# EAGLE design bleumaus-nrf52832-mk-1.0.0 (EAGLE 9.3.1)
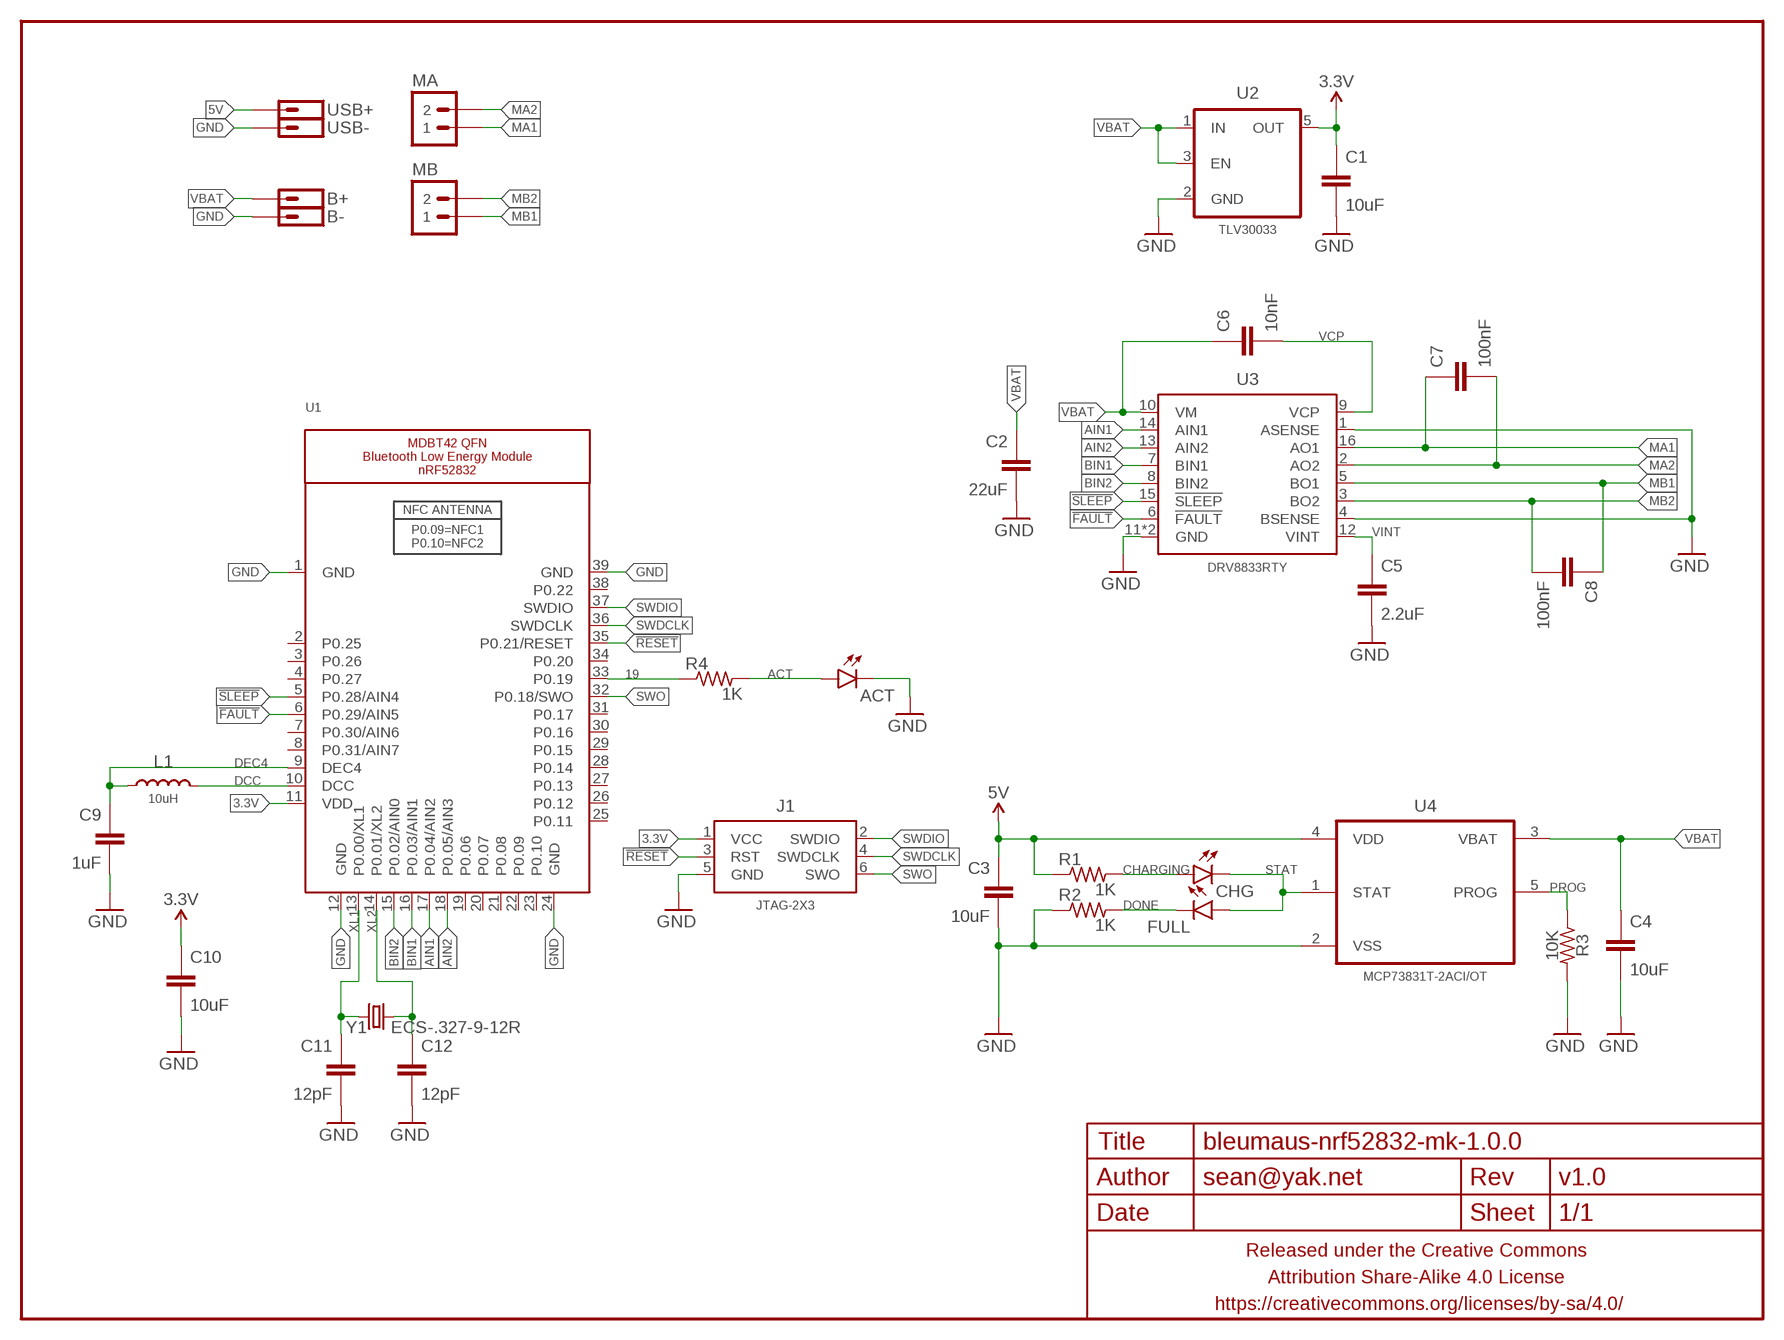
[diagram p0: schematic, sheet 1]

## Parts
ACT  LED0603-TIGHT  [LED-0603-TIGHT]
B+  M01SMD-1DIA  [1X01-SMD-1MM-DIA]
B-  M01SMD-1DIA  [1X01-SMD-1MM-DIA]
C1  10uF  CAPACITOR-CERAMICC0402  [C0402]
C2  22uF  CAPACITOR-CERAMICC1206  [C1206]
C3  10uF  CAPACITOR-CERAMICC0402  [C0402]
C4  10uF  CAPACITOR-CERAMICC0402  [C0402]
C5  2.2uF  CAPACITOR-CERAMICC0402  [C0402]
C6  10nF  CAPACITOR-CERAMICC0402  [C0402]
C7  100nF  CAPACITOR-CERAMICC0402  [C0402]
C8  100nF  CAPACITOR-CERAMICC0402  [C0402]
C9  1uF  CAPACITOR-CERAMICC0402  [C0402]
C10  10uF  CAPACITOR-CERAMICC0603-TIGHTER  [C0603-TIGHTER]
C11  12pF  CAPACITOR-CERAMICC0402  [C0402]
C12  12pF  CAPACITOR-CERAMICC0402  [C0402]
CHG  LED0603-TIGHT  [LED-0603-TIGHT]
FRAME1  FRAME-LETTERNO_PACKAGE  [DUMMY]
FULL  LED0603-TIGHT  [LED-0603-TIGHT]
J1  JTAG-2X3  [2X3-1.27MM-SMD]
L1  10uH  INDUCTOR0603  [0603]
MA  M02PTH-2MM  [1X02-2MM-PTH]
MB  M02PTH-2MM  [1X02-2MM-PTH]
R1  1K  RESISTORR0402  [R0402]
R2  1K  RESISTORR0402  [R0402]
R3  10K  RESISTORR0402  [R0402]
R4  1K  RESISTORR0402  [R0402]
U1  NRF52832_MODULE_MDBT42_NO2324  [BLE_MODULE_RAYTAC_MDBT42_NO2324]
U2  TLV30033  V_REG_ENTLV700XXDCK-TIGHTER  [SC70-TIGHTER]
U3  DRV8833RTY  [PWQFN-16]
U4  MCP73831T-2ACI/OT  [SOT95P280X145-5N]
USB+  M01SMD-1DIA  [1X01-SMD-1MM-DIA]
USB-  M01SMD-1DIA  [1X01-SMD-1MM-DIA]
Y1  ECS-.327-9-12R  CRYSTAL2X1.2MM  [CRYSTAL-2X1.2MM]

## Nets
3.3V: C1.1 C10.1 J1.1(VCC) U1.11(VDD) U2.5(OUT)
5V: C3.1 R1.1 U4.4(VDD) USB+.P$1
19: R4.1 U1.33(P0.19)
!FAULT: U1.6(P0.29/AIN5) U3.6(!FAULT)
!RESET: J1.3(RST) U1.35(P0.21/RESET)
!SLEEP: U1.5(P0.28/AIN4) U3.15(!SLEEP)
ACT: ACT.A R4.2
AIN1: U1.17(P0.04/AIN2) U3.14(AIN1)
AIN2: U1.18(P0.05/AIN3) U3.13(AIN2)
BIN1: U1.16(P0.03/AIN1) U3.7(BIN1)
BIN2: U1.15(P0.02/AIN0) U3.8(BIN2)
CHARGING: CHG.A R1.2
DCC: L1.2 U1.10(DCC)
DEC4: C9.1 L1.1 U1.9(DEC4)
DONE: FULL.C R2.2
GND: ACT.C B-.P$1 C1.2 C2.2 C3.2 C4.2 C5.2 C9.2 C10.2 C11.2 C12.2 J1.5(GND) R2.1 R3.2 U1.1(GND) U1.12(GND) U1.24(GND) U1.39(GND) U2.2(GND) U3.1(ASENSE) U3.4(BSENSE) U3.11(GND) U3.17(GND) U4.2(VSS) USB-.P$1
MA1: C7.1 MA.P$1 U3.16(AO1)
MA2: C7.2 MA.P$2 U3.2(AO2)
MB1: C8.1 MB.P$1 U3.5(BO1)
MB2: C8.2 MB.P$2 U3.3(BO2)
PROG: R3.1 U4.5(PROG)
STAT: CHG.C FULL.A U4.1(STAT)
SWDCLK: J1.4(SWDCLK) U1.36(SWDCLK)
SWDIO: J1.2(SWDIO) U1.37(SWDIO)
SWO: J1.6(SWO) U1.32(P0.18/SWO)
VBAT: B+.P$1 C2.1 C4.1 C6.1 U2.1(IN) U2.3(EN) U3.10(VM) U4.3(VBAT)
VCP: C6.2 U3.9(VCP)
VINT: C5.1 U3.12(VINT)
XL1: C11.1 U1.13(P0.00/XL1) Y1.1
XL2: C12.1 U1.14(P0.01/XL2) Y1.2
Unconnected: U1.2(P0.25) U1.3(P0.26) U1.4(P0.27) U1.7(P0.30/AIN6) U1.8(P0.31/AIN7) U1.19(P0.06) U1.20(P0.07) U1.21(P0.08) U1.22(P0.09) U1.23(P0.10) U1.25(P0.11) U1.26(P0.12) U1.27(P0.13) U1.28(P0.14) U1.29(P0.15) U1.30(P0.16) U1.31(P0.17) U1.34(P0.20) U1.38(P0.22)

## Library data of the parts
ACT CHG FULL = a_parts:LED: LEDs Standard schematic elements and footprints for 5mm, 3mm, 1206, and 0603 sized LEDs. 5mm - Spark Fun Electronics SKU : COM-00529 (and others)
B+ B- USB+ USB- = a_parts:M01: Header 1 Standard 1-pin 0.1" header. Use with straight break away headers (SKU : PRT-00116), right angle break away headers (PRT-00553), swiss pins (PRT-00743), machine pins (PRT-00117), and female headers (PRT-00115).
C1-C12 = a_parts:CAPACITOR-CERAMIC: CAPACITOR, European symbol
FRAME1 = a_parts:FRAME-LETTER: Schematic Frame Standard 8.5x11 US Letter frame; DESIGNER: sean@yak.net; VERSION: v1.0
J1 = a_parts:JTAG-2X3
L1 = a_parts:INDUCTOR: Inductors Basic Inductor/Choke - 0603 and 1206. Footprints are not proven and vary greatly between part numbers. SRN6045- 33uH, 20% 1.4A SDR0403-560KL - 56uH, 10%, 500mA RMS/740mA peak
MA MB = a_parts:M02: Standard 2-pin 0.1" header. Use with - straight break away headers ( PRT-00116) - right angle break away headers (PRT-00553) - swiss pins (PRT-00743) - machine pins (PRT-00117) - female headers (PRT-00115) Molex polarized connector foot print use with: PRT-08233 with associated crimp pins and housings. 2.54_SCREWTERM for use with PRT-10571. 3.5mm Screw Terminal footprints for PRT-08084 5mm Screw Terminal footprints for use with PRT-08433
R1-R4 = a_parts:RESISTOR: RESISTOR, American symbol
U1 = a_parts:NRF52832_MODULE_MDBT42_NO2324: MDBT42 - BLE Module (nRF52832 QFN) VDD: 1.7-3.6V
U2 = a_parts:V_REG_EN
U3 = a_parts:DRV8833
U4 = a_parts:MCP73831T-2ACI/OT: Charge Management Controller; MPN: MCP73831T-2ACI/OT; OC_FARNELL: 1332158; OC_NEWARK: 56K7045; PACKAGE: SOT-5; SUPPLIER: Microchip
Y1 = a_parts:CRYSTAL: Various standard crystals. Proven footprints. Spark Fun Electronics SKU : COM-00534

## Board
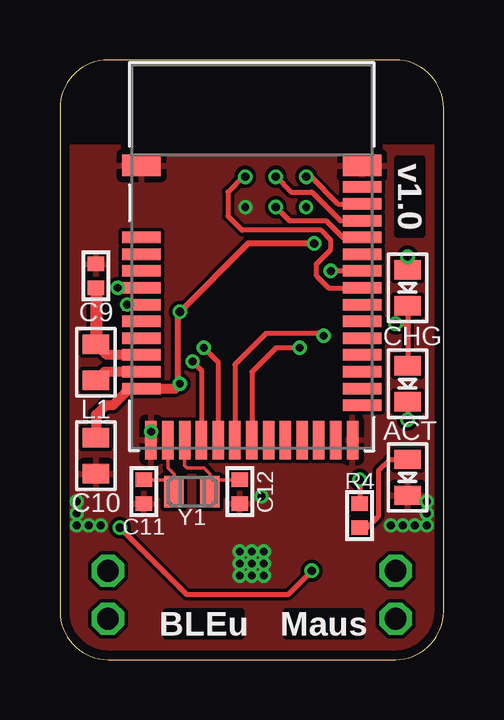
[diagram p1: board, top side]
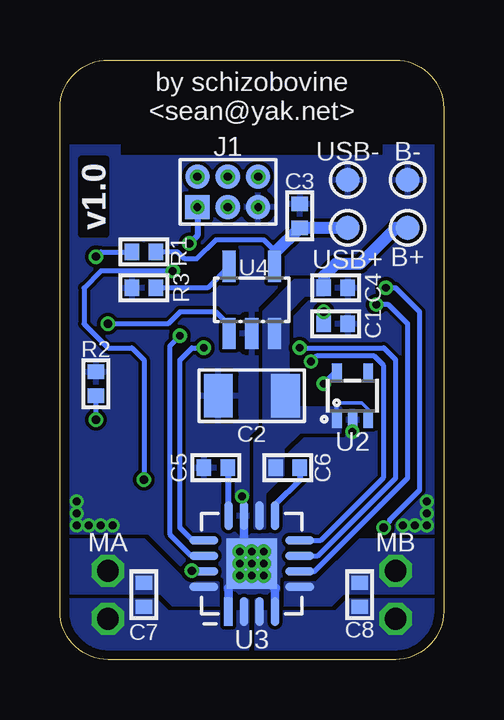
[diagram p2: board, bottom side, seen from below]

Size 16 x 25 mm. Coordinates in mm from the lower left corner, seen from the top.
Outline: 14,25 2,25 arc90 0,23 0,2 arc90 2,0 14,0 arc90 16,2 16,23 arc90 14,25
Copper layers (1*16): Top 0.035559375mm / dielectric 1.6mm / Bottom 0.035559375mm
Design rules "oshpark-2layer": minimum track width 6mil, minimum drill 10mil, track to track 6mil, track to pad 6mil, pad to pad 6mil, via to via 6mil, smd to smd 0mil, copper to edge 15mil, drill to drill 6mil, minimum pad ring 5mil, minimum via ring 5mil, stop-mask expansion 2.5mil, vias tented up to drill 20mil, thermal gap 10mil

### Footprints (pad centres in the part's own frame; a part is rotated, then mirrored left to right if it is on the bottom)
LED-0603-TIGHT = smd 0.8 x 1.1: A 0.75,0; C -0.75,0
1X01-SMD-1MM-DIA = smd 1 x 1: P$1 0,0
C0402 = smd 0.6 x 0.7: 1 -0.5,0; 2 0.5,0
C1206 = smd 1.2 x 1.8: 1 -1.4,0; 2 1.4,0
C0603-TIGHTER = smd 0.8 x 1.1: 1 -0.75,0; 2 0.75,0
2X3-1.27MM-SMD = smd 1.016 x 1.016: 1 -1.27,-0.635; 2 -1.27,0.635; 3 0,-0.635; 4 0,0.635; 5 1.27,-0.635; 6 1.27,0.635
0603 = smd 0.8 x 1.1: 1 -0.75,0; 2 0.75,0
1X02-2MM-PTH = drill 0.9 octagon: P$1 -1,0; P$2 1,0
R0402 = smd 0.6 x 0.7: 1 -0.5,0; 2 0.5,0
BLE_MODULE_RAYTAC_MDBT42_NO2324 = smd 1.6 x 0.9: 1 -4.6,3.8; 39 4.6,3.8 | smd 1.6 x 0.48: 2 -4.6,0.8; 3 -4.6,0.1; 4 -4.6,-0.6; 5 -4.6,-1.3; 6 -4.6,-2; 7 -4.6,-2.7; 8 -4.6,-3.4; 9 -4.6,-4.1; 10 -4.6,-4.8; 11 -4.6,-5.5; 25 4.6,-6.2; 26 4.6,-5.5; 27 4.6,-4.8; 28 4.6,-4.1; 29 4.6,-3.4; 30 4.6,-2.7; 31 4.6,-2; 32 4.6,-1.3; 33 4.6,-0.6; 34 4.6,0.1; 35 4.6,0.8; 36 4.6,1.5; 37 4.6,2.2; 38 4.6,2.9 | smd 0.48 x 1.6: 12 -4.2,-7.65; 13 -3.5,-7.65; 14 -2.8,-7.65; 15 -2.1,-7.65; 16 -1.4,-7.65; 17 -0.7,-7.65; 18 0,-7.65; 19 0.7,-7.65; 20 1.4,-7.65; 21 2.1,-7.65; 22 2.8,-7.65; 23 3.5,-7.65; 24 4.2,-7.65
SC70-TIGHTER = smd 0.4 x 0.7: 1 -0.65,-1; 2 0,-1; 3 0.65,-1; 4 0.65,1; 5 -0.65,1
PWQFN-16 = smd 0.35 x 1.2: 1 -0.975,-2; 2 -0.325,-2; 3 0.325,-2; 4 0.975,-2; 9 0.975,2; 10 0.325,2; 11 -0.325,2; 12 -0.975,2 | smd 1.2 x 0.35: 5 2,-0.975; 6 2,-0.325; 7 2,0.325; 8 2,0.975; 13 -2,0.975; 14 -2,0.325; 15 -2,-0.325; 16 -2,-0.975 | smd 2.1 x 2.1: 17 0,0
SOT95P280X145-5N = smd 1.3 x 0.55: 1 -1.4,0.95; 2 -1.4,0; 3 -1.4,-0.95; 4 1.4,-0.95; 5 1.4,0.95
CRYSTAL-2X1.2MM = smd 0.8 x 1.3: 1 -0.75,0; 2 0.75,0

### Placement (x,y rotation side)
ACT  14.5,7.6 90 top
B+  1.5,18 180 bottom
B-  1.5,20 0 bottom
C1  4.5,14 0 bottom
C2  8,11 180 bottom
C3  6,18.5 90 bottom
C4  4.5,15.5 0 bottom
C5  9.5,8 180 bottom
C6  6.5,8 0 bottom
C7  12.5,2.7 270 bottom
C8  3.5,2.7 270 bottom
C9  1.5,16 90 top
C10  1.5,8.5 270 top
C11  3.5,7 270 top
C12  7.5,7 270 top
CHG  14.5,15.5 90 top
FRAME1  0,0 0 top
FULL  14.5,11.5 90 top
J1  9,19.5 0 bottom
L1  1.5,12.4 270 top
MA  14,2.7 270 bottom
MB  2,2.7 270 bottom
R1  12.5,17 180 bottom
R2  14.5,11.5 270 bottom
R3  12.5,15.5 180 bottom
R4  12.5,6 270 top
U1  8,16.8 0 top
U2  3.8,11 0 bottom
U3  8,4 0 bottom
U4  8,15 90 bottom
USB+  4,18 180 bottom
USB-  4,20 0 bottom
Y1  5.5,7 0 top

### Tracks (layer width: path | path; a pad name or v marks a point on that pad's centre or on a via)
3.3V  (via drill 0.33, 0.35)
  Top 0.254: v10.6,17.35 7.85,17.35 v5,14.5 4.9,14.4 4.9,11.6 v5,11.5
  Top 0.406: C10.1 1.5,10.2 1.9,10.6 2.2,10.6 2.9,11.3 U1.11 4.8,11.3 v5,11.5
  Bottom 0.254: J1.1 10.27,17.68 v10.6,17.35 | U2.5 4.5,12 v5,11.5 | C1.1 v5,14.5
  other vias: 10.27,18.86
5V
  Bottom 0.2: U4.4 7.05,17.05 7.5,17.5 9.5,17.5 10.3,16.7 10.8,16.7 11.1,17 R1.1
  Bottom 0.508: USB+.P$1 C3.1 7.05,16.95 U4.4
19  (via drill 0.35)
  Top 0.2: U1.33 v11.3,16.2 | v12.5,7.5 R4.1
  Bottom 0.2: v11.3,16.2 14.3,16.2 15,15.5 15,14 14,13 13,13 12.5,12.5 v12.5,7.5
!FAULT  (via drill 0.33)
  Top 0.2: U1.6 v2.8,14.8
  Bottom 0.2: U3.6 5.39,3.67 1.5,7.57 1.5,14 2.3,14.8 v2.8,14.8
!RESET  (via drill 0.35)
  Top 0.2: J1.3 9.56,18.3 11.1,18.3 11.8,17.6 U1.35
  other vias: 9,18.86
!SLEEP  (via drill 0.33, 0.35)
  Top 0.2: v10.5,3.7 9.5,2.7 5.3,2.7 v2.5,5.5 | U1.5 v2.4,15.5
  Bottom 0.2: U3.15 10.47,3.67 v10.5,3.7 | v2.5,5.5 2.24,5.75 2.24,5.83 1,7.07 1,14.5 2,15.5 v2.4,15.5
ACT
  Top 0.2: R4.2 12.8,5.5 13.3,6 13.3,7.9 13.75,8.35 ACT.A
AIN1  (via drill 0.33)
  Top 0.2: v11,13.5 10.9,13.6 8.6,13.6 7.3,12.3 U1.17
  Bottom 0.2: U3.14 10.53,4.33 11.4,5.2 11.4,13.1 v11,13.5
AIN2  (via drill 0.33)
  Top 0.2: v10,13 9,13 8,12 U1.18
  Bottom 0.2: U3.13 10.47,4.97 11,5.5 11,12.5 10.5,13 v10,13
BIN1  (via drill 0.33)
  Top 0.2: v6,13 6.6,12.4 U1.16
  Bottom 0.2: U3.7 5.24,4.33 2,7.57 2,12.5 2.5,13 v6,13
BIN2  (via drill 0.33)
  Top 0.2: v5.53,12.43 5.9,12.06 U1.15
  Bottom 0.2: U3.8 5.12,4.97 2.5,7.6 2.5,12.26 2.89,12.65 5.31,12.65 v5.53,12.43
CHARGING  (via drill 0.35)
  Top 0.2: CHG.A v14.5,16.8
  Bottom 0.2: v14.5,16.8 14.3,17 R1.2
DCC
  Top 0.406: U1.10 1.85,12 L1.2
DEC4
  Top 0.406: U1.9 1.95,12.7 L1.1
  Top 0.508: C9.1 L1.1
DONE  (via drill 0.35)
  Top 0.2: FULL.C v14.5,10
  Bottom 0.2: v14.5,10 R2.2
GND  (via drill 0.33)
  Bottom 0.35: U3.4 7.03,2.98 | 7.03,2.98 7,3 | U3.1 8.97,2.98 9,3 | U3.11 8.32,4.83 v8,4.5 | 7.03,2.98 7.5,3.45 v7.5,3.5 | U3.17 v8.5,3.5
  other vias: 8.4,6.8 7.5,4.5 8.5,4.5 8.5,4 8,4 7.5,4 8,3.5 0.7,5.6 0.7,6.1 15.3,6.6 15.3,5.6 15.3,6.1 1.7,5.6 1.2,5.6 0.7,6.6 13.8,5.6 14.3,5.6 14.8,5.6 3.8,9.5 7.73,18.86
  pour Top (rank 6): 0,21.4 0,2 arc90 2,0 14,0 arc90 16,2 16,21.4
  pour Bottom (rank 6): 0,21.4 0,2 arc90 2,0 14,0 arc90 16,2 16,21.4
MA1
  pour Bottom (rank 5, no thermals): 16,1.5 9.4,1.5 9.4,3.2 10.7,3.2 12.5,5 16,5
MA2
  pour Bottom (rank 4, no thermals): 8.18,2.5 8.18,0 14,0 arc90 16,2 16,2.5 12,2.5 11.5,2 8.43,2 8.43,2.5
MB1
  pour Bottom (rank 5, no thermals): 0,1.5 6.6,1.5 6.6,3.2 5.3,3.2 3.5,5 0,5
MB2
  pour Bottom (rank 4, no thermals): 7.82,2.5 7.82,0 2,0 arc-90 0,2 0,2.5 4,2.5 4.5,2 7.57,2 7.57,2.5
PROG
  Bottom 0.2: U4.5 9.85,15.5 R3.1
STAT  (via drill 0.35)
  Top 0.2: CHG.C 14.5,14 | 14.5,14 FULL.A | v14,14 14.5,14
  Bottom 0.2: U4.1 8.95,13.95 9.5,14.5 11,14.5 11.5,14 v14,14
SWDCLK  (via drill 0.35)
  Top 0.2: J1.4 9.63,19.5 10.5,19.5 11.7,18.3 U1.36
  other vias: 9,20.14
SWDIO  (via drill 0.35)
  Top 0.2: J1.2 10.46,20.14 11.6,19 U1.37
  other vias: 10.27,20.14
SWO  (via drill 0.35)
  Top 0.2: J1.6 7.63,20.14 7,19.5 7,18.5 7.6,17.9 10.9,17.9 11.3,17.5 11.3,17.1 10.7,16.5 10.7,16 11.2,15.5 U1.32
  other vias: 7.73,20.14
VBAT
  Bottom 0.152: U2.1 4.45,10.45 4.5,10.5 4.3,10.7 3.4,10.7 3.15,10.45 U2.3
  Bottom 0.508: B+.P$1 2,18 3.5,16.5 4.5,16.5 5,16 C4.1
  pour Bottom (no thermals): 7.87,5.5 7.87,9.13 7.5,9.5 7.5,14.51 6.21,15.8 5,15.8 5,15.2 5.8,15.2 6.5,14.5 6.5,10.5 4.3,10.5 4.3,9.5 6,9.5 6.7,8.8 6.7,7.7 7.47,6.93 7.47,5.5
VCP
  Bottom 0.254: C6.2 6,7.5 7.03,6.47 U3.9
VINT
  Bottom 0.254: C5.1 9,6.03 U3.12
XL1
  Top 0.152: U1.13 4.5,8 4.75,7.75 4.75,7.5 | 4.75,7.5 Y1.1 | C11.1 4.75,7.5
XL2
  Top 0.152: U1.14 5.2,8.1 5.3,8 6,8 6.25,7.75 6.25,7.5 | 6.25,7.5 Y1.2 | C12.1 6.25,7.5

### Text on the board
Top: BLEu | Maus
tPlace: BLEu | Maus
bPlace: by schizobovine / <sean@yak.net>